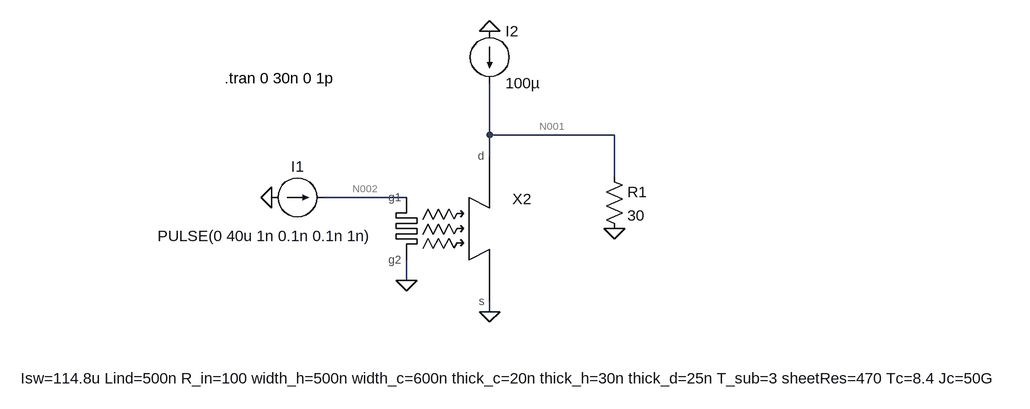
[diagram p0: schematic hTron_test.asc]
hTron_test.asc, the LTspice schematic file:
Version 4
SHEET 1 1196 680
WIRE 288 16 288 -64
WIRE 480 16 288 16
WIRE 288 48 288 16
WIRE 480 80 480 16
WIRE 160 112 32 112
WIRE 160 240 160 208
WIRE 288 288 288 272
FLAG -48 112 0
FLAG 288 -144 0
FLAG 160 240 0
FLAG 288 288 0
FLAG 480 160 0
SYMBOL current -48 112 R270
WINDOW 0 32 40 VTop 2
WINDOW 3 -44 -10 VBottom 2
WINDOW 123 0 0 Left 0
WINDOW 39 0 0 Left 0
SYMATTR InstName I1
SYMATTR Value PULSE(0 40u 1n 0.1n 0.1n 1n)
SYMBOL current 288 -144 R0
WINDOW 123 0 0 Left 0
WINDOW 39 0 0 Left 0
SYMATTR InstName I2
SYMATTR Value 100µ
SYMBOL res 464 64 R0
SYMATTR InstName R1
SYMATTR Value 30
SYMBOL hTron_debug 288 160 R0
WINDOW 39 39 246 Bottom 2
SYMATTR SpiceLine Isw=114.8u Lind=500n R_in=100 width_h=500n width_c=600n thick_c=20n thick_h=30n thick_d=25n T_sub=3 sheetRes=470 Tc=8.4 Jc=50G
SYMATTR InstName X2
TEXT -120 -72 Left 2 !.tran 0 30n 0 1p

The netlist it stands for:
* hTron_test.asc
I1 0 N002 PULSE(0 40u 1n 0.1n 0.1n 1n)
I2 0 N001 100µ
R1 N001 0 30
XX2 N001 N002 0 0 hTron_debug params: hTron_debug Isw=114.8u Lind=500n R_in=100 width_h=500n width_c=600n thick_c=20n thick_h=30n thick_d=25n T_sub=3 sheetRes=470 Tc=8.4 Jc=50G  ; pins d g1 g2 s
.tran 0 30n 0 1p
.backanno
.end

* Results of the author's LTspice run, read from the files saved beside the schematic
* Operating Point, zero values left out:
*   I(I2) = 100 µA
*   Ix(x2:D) = 100 µA
*   Ix(x2:S) = -100 µA
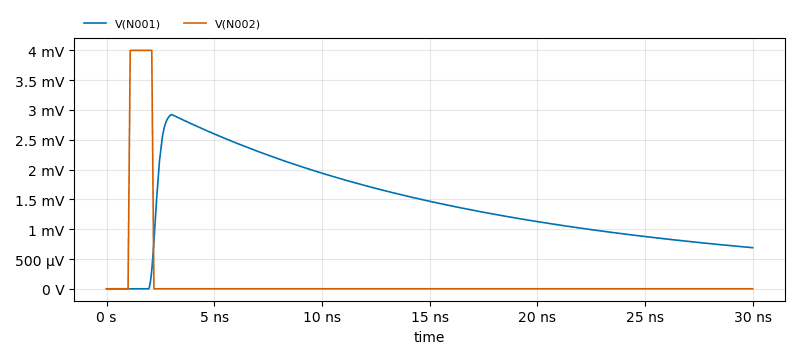
[diagram p1: Transient Analysis of hTron_test.asc, plotted from the saved traces]
* Transient Analysis, 1 run:
*   V(N001): min 0 V, max 2.922 mV, average 1.416 mV, rms 1.594 mV, last 689.7 µV
*   V(N002): min 0 V, max 4.001 mV, average 146.7 µV, rms 761.6 µV, last 0 V